# Altium schematic sheet tsal-logic.SchDoc: tsal-logic
size A4; Date: 05.10.2017; CheckedBy: UNCHECKED; Author: Leon Loeser; Organization: Baltic Racing; Address1: Zur Schwedenschanze 15; Address2: Haus 18; Address3: 18435 Stralsund; Revision: 1.0; SheetNumber: 2; SheetTotal: 2; Rules: EV4.10, T11.9; ProjectName: Projekt
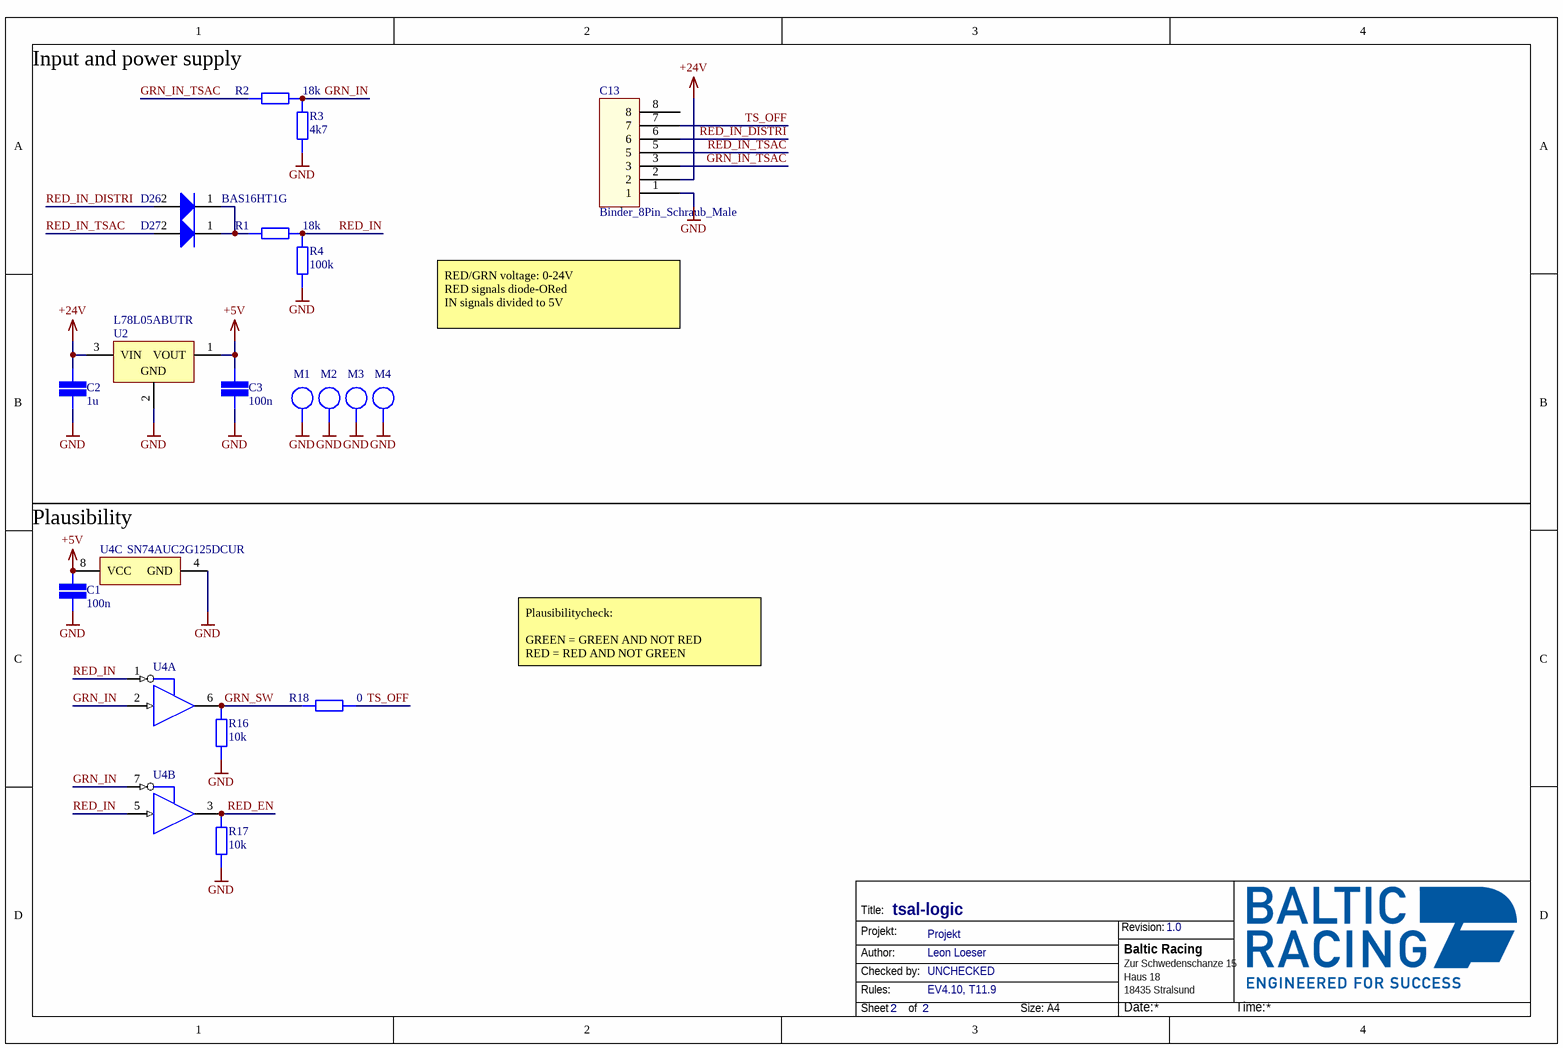
[diagram p0: tsal-logic.SchDoc]

## Parts
C1  value 100n  [CAP 0603/1608]  (hidden comment: SMD Capacitor)
C2  value 1u  [CAP 0805/2012]  (hidden comment: SMD Capacitor)
C3  value 100n  [CAP 0603/1608]  (hidden comment: SMD Capacitor)
C13  Binder_8Pin_Schraub_Male  [09 0427 30 08]
D26  BAS16HT1G  [ONSC-SOD-323-2-477-02_V]
D27  BAS16HT1G  [ONSC-SOD-323-2-477-02_V]  (value not drawn)
M1  mounting pad  [MOUNTING_PAD_M3]  (value not drawn)  (no BOM)
M2  mounting pad  [MOUNTING_PAD_M3]  (value not drawn)  (no BOM)
M3  mounting pad  [MOUNTING_PAD_M3]  (value not drawn)  (no BOM)
M4  mounting pad  [MOUNTING_PAD_M3]  (value not drawn)  (no BOM)
R1  value 18k  [STACKPOLE CSR0603]  (hidden comment: SMD Resistor)
R2  value 18k  [STACKPOLE CSR0603]  (hidden comment: SMD Resistor)
R3  value 4k7  [STACKPOLE CSR0603]  (hidden comment: SMD Resistor)
R4  value 100k  [STACKPOLE CSR0603]  (hidden comment: SMD Resistor)
R16  value 10k  [STACKPOLE CSR0603]  (hidden comment: SMD Resistor)
R17  value 10k  [STACKPOLE CSR0603]  (hidden comment: SMD Resistor)
R18  value 0  [STACKPOLE CSR0603]  (hidden comment: SMD Resistor)
U2  L78L05ABUTR  [SOT-89_N]
U4  SN74AUC2G125DCUR  [DCU0008A_M]  (value not drawn)  (parts A,B,C of 3)

## Nets
+5V: C1.2 C3.2 U2.1(VOUT) U4.8(VCC)
+24V: C2.2 C13.2 U2.3(VIN)
GND: C1.1 C2.1 C3.1 C13.1 M1.1 M2.1 M3.1 M4.1 R3.1 R4.1 R16.1 R17.1 U2.2(GND) U4.4(GND)
GRN_IN: R2.2 R3.2 U4.2(1A) U4.7(2~{OE})
GRN_IN_TSAC: C13.3 R2.1
GRN_SW: R16.2 R18.1 U4.6(1Y)
RED_EN: R17.2 U4.3(2Y)
RED_IN: R1.2 R4.2 U4.1(1~{OE}) U4.5(2A)
RED_IN_DISTRI: C13.6 D26.2(A)
RED_IN_TSAC: C13.5 D27.2(A)
TS_OFF: C13.7 R18.2
NetD26_1: D26.1(K) D27.1(K) R1.1

Not connected (* = marked no-connect by the designer): C13 8

## Notes on the sheet
- (near R2) Input and power supply
- RED/GRN voltage: 0-24V
  RED signals diode-ORed
  IN signals divided to 5V
- Plausibility
- Plausibilitycheck:
  GREEN = GREEN AND NOT RED
  RED = RED AND NOT GREEN
- Title:
- Projekt:
- Revision:
- Author:
- Rules:
- Checked by:
- Sheet
- of
- Size:
- A4
- Date:
- Time:

## Library data of the parts
C1-C3 = SMD Capacitor: Capacitor with multiple Footprints
D26 D27 = CMP-1054-00068-1: Switching Diode, 2-Pin SOD-323, Pb-Free, Tape and Reel; Manufacturer: On Semiconductor; Configuration: Single; IF Max (A): 0.2; trr Max (ns): 6; Packing: Tape and Reel; ComponentLink2URL: http://www.onsemi.com/pub_link/Collateral/BAS16HT1-D.PDF; ComponentLink3Description: Package Specification; RoHS: TRUE; PackageDescription: 2-Pin SOD, Body 1.7 x 1.25 mm; PackageReference: SOD-323-2-477-02; PartNumber: BAS16HT1G; ComponentLink1URL: http://www.onsemi.com/; Mounting Technology: Surface Mount; ComponentLink1Description: Manufacturer URL; ComponentLink2Description: Datasheet; DatasheetVersion: Rev. 11; PackageVersion: Rev. H, 03/2007; ComponentLink3URL: http://www.onsemi.com/pub_link/Collateral/477-02.PDF.1
R1-R4 R16-R18 = SMD Resistor: Resistor with multiple footprints
U2 = CMP-0244-00406-1: Positive Voltage Regulator, 5V, 4-Pin SOT-89, Tape and Reel; PackageVersion: 2011; DatasheetVersion: 1/02/2011; PackageDescription: 3-Pin SOT-89 Package 1.5 mm Pitch, 4.1 mm Lead Span; PackageReference: SOT-89; ComponentLink2Description: Datasheet; ComponentLink1URL: http://www.st.com; ComponentLink1Description: Manufacturer URL; ComponentLink2URL: http://www.st.com/internet/com/TECHNICAL_RESOURCES/TECHNICAL_LITERATURE/DATASHEET/CD00000446.pdf
U4 = CMP-0859-00610-3: Dual Bus Buffer Gate with 3-State Outputs, DCU0008A, LARGE T&R; Manufacturer: Texas Instruments; Generic Part Number: SN74AUC2G125; DatasheetVersion: SCES532D; PackageReference: DCU0008A